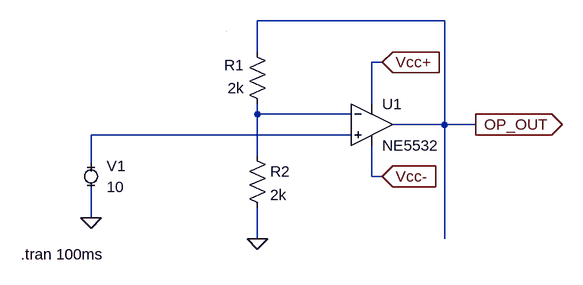
[diagram p0: schematic OPAMP.asc]
OPAMP.asc, the LTspice schematic file:
Version 4
SHEET 1 880 680
WIRE 336 -16 48 -16
WIRE 48 32 48 -16
WIRE 240 48 224 48
WIRE 224 112 224 48
WIRE 48 128 48 112
WIRE 192 128 48 128
WIRE 336 144 336 -16
WIRE 336 144 256 144
WIRE 384 144 336 144
WIRE 192 160 -208 160
WIRE 48 192 48 128
WIRE -208 208 -208 160
WIRE 224 224 224 176
WIRE 240 224 224 224
WIRE -208 288 -208 240
WIRE 48 320 48 272
WIRE 336 320 336 144
WIRE 0 0 0 0
FLAG 240 48 Vcc+
IOPIN 240 48 In
FLAG 48 320 0
FLAG 384 144 OP_OUT
IOPIN 384 144 Out
FLAG 240 224 Vcc-
IOPIN 240 224 In
FLAG -208 288 0
SYMBOL res 64 128 R180
WINDOW 0 36 76 Left 2
WINDOW 3 36 40 Left 2
SYMATTR InstName R1
SYMATTR Value 2k
SYMBOL res 32 176 R0
SYMATTR InstName R2
SYMATTR Value 2k
SYMBOL EXTRA\\AudioOpamp\\TI\\NE5532 224 144 R0
SYMATTR InstName U1
SYMBOL MiniSyms4\\voltage- -208 224 R0
SYMATTR InstName V1
SYMATTR Value 10
TEXT -316 344 Left 2 !.tran 100ms

The netlist it stands for:
* OPAMP.asc
R1 N001 OP_OUT 2k
R2 N001 0 2k
XU1 N002 N001 Vcc+ Vcc- OP_OUT NE5532  ; pins In+ In- V+ V- OUT
V1 N002 0 10
.tran 100ms
.backanno
.end